# EAGLE design selecsch (EAGLE 9.6.2)
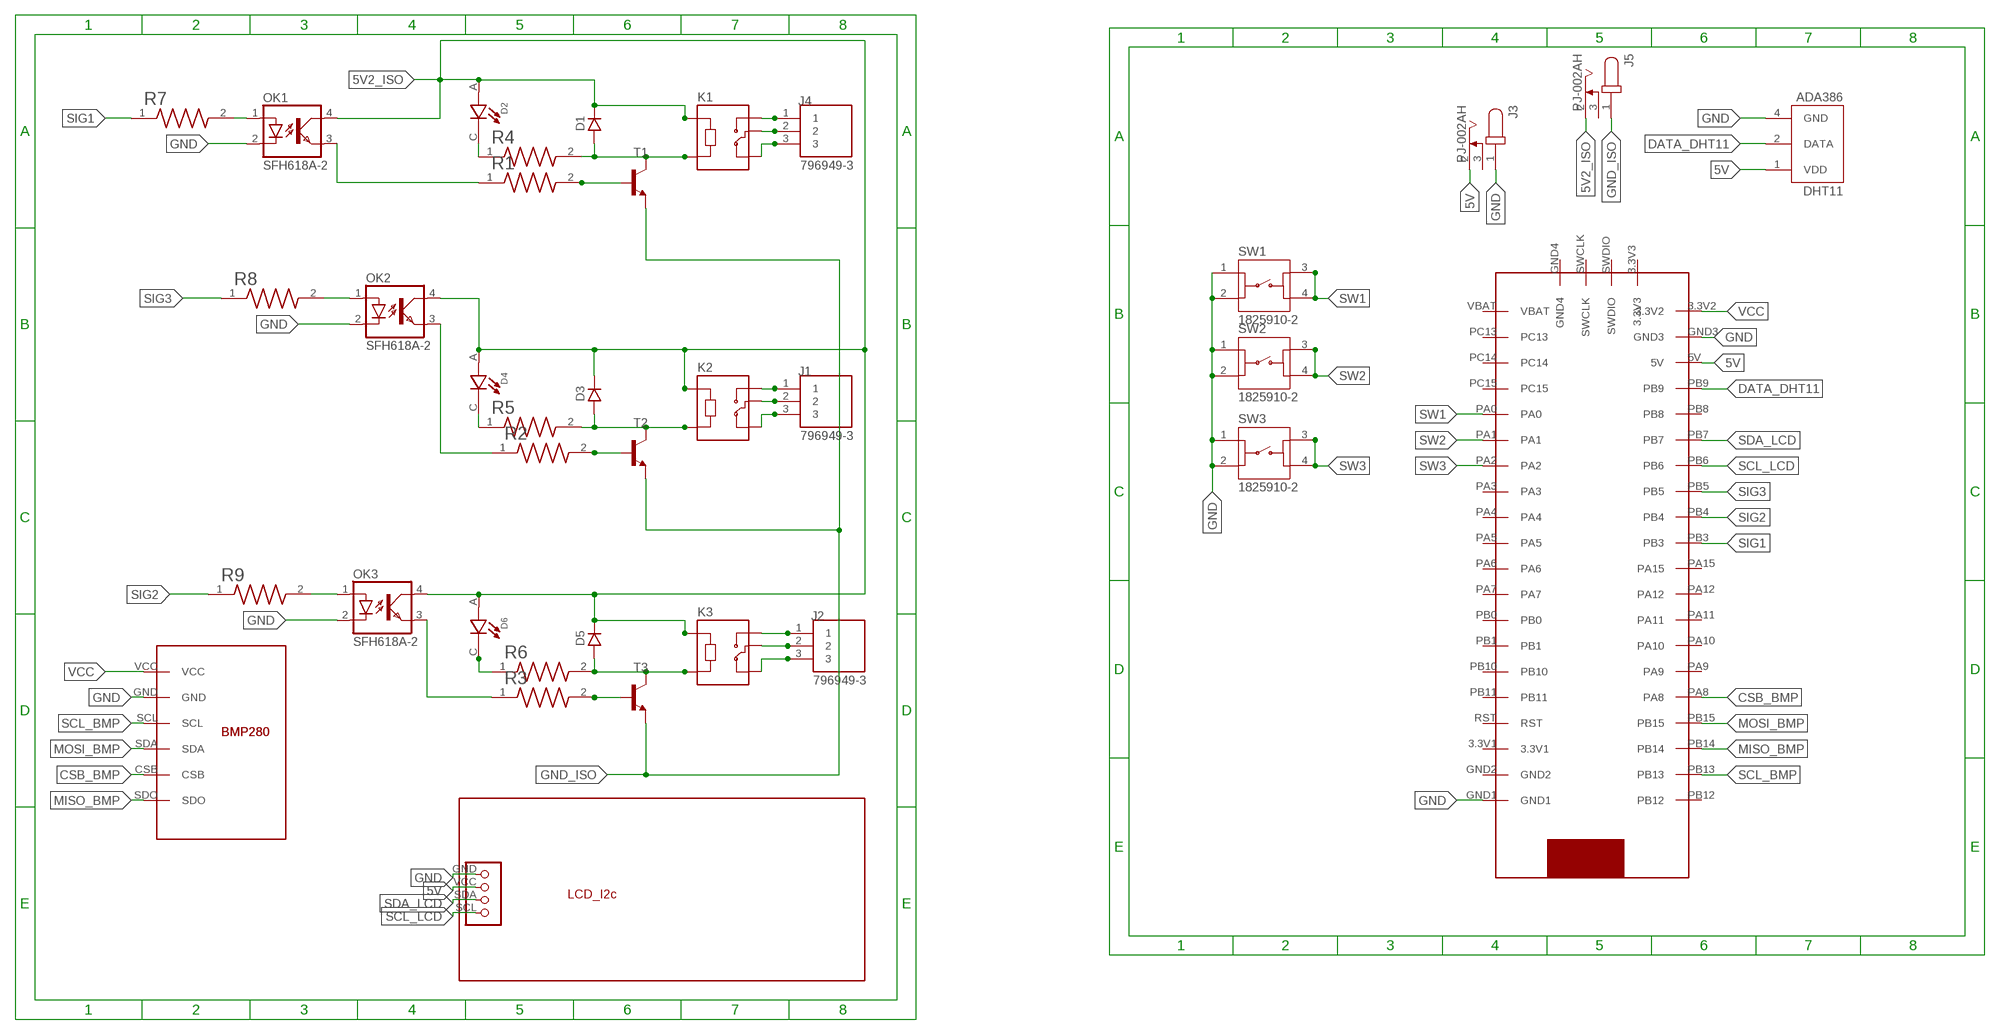
[diagram p0: schematic, sheet 1]

## Parts
D1  1N4007  [DO41]
D2  L08R5000Q1  [LEDRD254W57D500H1070]
D3  1N4007  [DO41]
D4  L08R5000Q1  [LEDRD254W57D500H1070]
D5  1N4007  [DO41]
D6  L08R5000Q1  [LEDRD254W57D500H1070]
DHT11  ADA386  [XDCR_ADA386]
J1  796949-3  [TE_796949-3]
J2  796949-3  [TE_796949-3]
J3  PJ-002AH  [CUI_PJ-002AH]
J4  796949-3  [TE_796949-3]
J5  PJ-002AH  [CUI_PJ-002AH]
K1  SRD-05VDC-SL-C  [RELAY_SRD-05VDC-SL-C]
K2  SRD-05VDC-SL-C  [RELAY_SRD-05VDC-SL-C]
K3  SRD-05VDC-SL-C  [RELAY_SRD-05VDC-SL-C]
LCD16X1  LCD16X2  [LCD16X2]
OK1  SFH618A-2  [DIP4]
OK2  SFH618A-2  [DIP4]
OK3  SFH618A-2  [DIP4]
R1  2-1623927-3  [RESAD700W45L350D185]
R2  2-1623927-3  [RESAD700W45L350D185]
R3  2-1623927-3  [RESAD700W45L350D185]
R4  2-1623927-3  [RESAD700W45L350D185]
R5  2-1623927-3  [RESAD700W45L350D185]
R6  2-1623927-3  [RESAD700W45L350D185]
R7  2-1623927-3  [RESAD700W45L350D185]
R8  2-1623927-3  [RESAD700W45L350D185]
R9  2-1623927-3  [RESAD700W45L350D185]
SW1  1825910-2  [TE_1825910-2]
SW2  1825910-2  [TE_1825910-2]
SW3  1825910-2  [TE_1825910-2]
T1  BC547TO92-CBE  [TO92-CBE]
T2  BC547TO92-CBE  [TO92-CBE]
T3  BC547TO92-CBE  [TO92-CBE]
U$1  BMP280  [BMP280]
U$2  STM32F103C8T6BLUEPILL  [STM32F103C8T6BLUEPILL]

## Nets
5V: DHT11.1(VDD) J3.2 LCD16X1.VCC U$2.5V
5V2_ISO: D1.K D2.A D3.K D4.A D5.K D6.A J5.2 K1.A1 K2.A1 K3.A1 OK1.4(COL) OK2.4(COL) OK3.4(COL)
CSB_BMP: U$1.CSB U$2.PA8
DATA_DHT11: DHT11.2(DATA) U$2.PB9
GND: DHT11.4(GND) J3.1 LCD16X1.GND SW1.1 SW1.2 SW2.1 SW2.2 SW3.1 SW3.2 U$1.GND U$2.GND1 U$2.GND3
GND_ISO: J5.1 T1.E T2.E T3.E
MISO_BMP: U$1.SDO U$2.PB14
MOSI_BMP: U$1.SDA U$2.PB15
N$1: D1.A K1.A2 R4.2 T1.C
N$2: R1.2 T1.B
N$3: J4.1 K1.NO
N$4: J4.2 K1.COM
N$5: J4.3 K1.NC
N$6: D3.A K2.A2 R5.2 T2.C
N$7: R2.2 T2.B
N$8: J1.1 K2.NO
N$9: D2.C R4.1
N$10: J1.2 K2.COM
N$11: J1.3 K2.NC
N$12: D5.A K3.A2 R6.2 T3.C
N$13: D6.C R6.1
N$14: R3.2 T3.B
N$15: J2.1 K3.NO
N$16: J2.2 K3.COM
N$17: J2.3 K3.NC
N$18: D4.C R5.1
N$19: OK1.3(EMIT) R1.1
N$20: OK3.3(EMIT) R3.1
N$21: OK1.2(C)
N$22: OK1.1(A) R7.2
N$23: OK3.1(A) R9.2
N$24: OK3.2(C)
N$25: OK2.1(A) R8.2
N$26: OK2.2(C)
N$27: OK2.3(EMIT) R2.1
SCL_BMP: U$1.SCL U$2.PB13
SCL_LCD: LCD16X1.SCL U$2.PB6
SDA_LCD: LCD16X1.SDA U$2.PB7
SIG1: R7.1 U$2.PB3
SIG2: R9.1 U$2.PB4
SIG3: R8.1 U$2.PB5
SW1: SW1.3 SW1.4 U$2.PA0
SW2: SW2.3 SW2.4 U$2.PA1
SW3: SW3.3 SW3.4 U$2.PA2
VCC: U$1.VCC U$2.3.3V2
Unconnected: J3.3 J5.3 U$2.3.3V1 U$2.3.3V3 U$2.GND2 U$2.GND4 U$2.PA3 U$2.PA4 U$2.PA5 U$2.PA6 U$2.PA7 U$2.PA9 U$2.PA10 U$2.PA11 U$2.PA12 U$2.PA15 U$2.PB0 U$2.PB1 U$2.PB8 U$2.PB10 U$2.PB11 U$2.PB12 U$2.PC13 U$2.PC14 U$2.PC15 U$2.RST U$2.SWCLK U$2.SWDIO U$2.VBAT

## Library data of the parts
D1 D3 D5 = 1N4007:1N4007: Usmernovaci dioda - 1A, 1000V Check availability <https://pricing.snapeda.com/parts/1N4007-T/Diodes%20Incorporated/view-part?ref=eda>; AVAILABILITY: In Stock; DESCRIPTION: Diode Standard 1000 V 1A Through Hole DO-41; MF: Diodes Incorporated; MP: 1N4007-T; PACKAGE: DO-41 Diodes Inc.; PRICE: None; PURCHASE-URL: https://pricing.snapeda.com/search/part/1N4007-T/?ref=eda
D2 D4 D6 = LED_orange:L08R5000Q1: LED, Orange, Through Hole, T-1 3/4 (5mm), 30 mA, 2.1 V, 635 nm Check availability <https://pricing.snapeda.com/parts/L08R5000Q1/LED%20Technology/view-part?ref=eda>; AVAILABILITY: In Stock; DESCRIPTION: LED, 5MM, ORANGE; LED / Lamp Size: 5mm / T-1 3/4; LED Colour: Orange; Typ Luminous Intensity: 4.3mcd; Viewing Angle: ...; MF: LED Technology; MP: L08R5000Q1; PACKAGE: None; PRICE: None
DHT11 = DHT11_sensor:ADA386: DHT11 basic temperature-humidity sensor + extras Check availability <https://pricing.snapeda.com/parts/ADA386/Adafruit%20Industries/view-part?ref=eda>; AVAILABILITY: Not in stock; DESCRIPTION: DHT11 basic temperature-humidity sensor + extras; MF: Adafruit Industries; MP: ADA386; PACKAGE: None; PRICE: None
J1 J2 J4 = 3_pin_terminal_connector_for relay:796949-3: Check availability <https://pricing.snapeda.com/parts/796949-3/TE%20Connectivity/view-part?ref=eda>; AVAILABILITY: In Stock; COMMENT: 796949-3; DESCRIPTION: Connector Terminal Blocks 3 Position 5.08mm Solder Straight Thru-Hole 17.5A/Contact; MF: TE Connectivity; MP: 796949-3; PACKAGE: None; PRICE: None; PURCHASE-URL: https://pricing.snapeda.com/search/part/796949-3/?ref=eda
J3 J5 = DC_jack:PJ-002AH: 2.0 mm Center Pin, 5.0 A, Right Angle, Through Hole, Dc Power Jack Connector Check availability <https://pricing.snapeda.com/parts/PJ-002AH/CUI%20Devices/view-part?ref=eda>; AVAILABILITY: In Stock; CUI_PURCHASE_URL: https://www.cuidevices.com/product/interconnect/connectors/dc-power-connectors/jacks/pj-002ah?utm_source=snapeda.com&utm_medium=referral&utm_campaign=snapedaBOM; DESCRIPTION: 2.0 x 6.5 mm, 5.0 A, Horizontal, Through Hole, Dc Power Jack Connector; MF: CUI Devices; MP: PJ-002AH; PACKAGE: None; PRICE: None; PURCHASE-URL: https://pricing.snapeda.com/search/part/PJ-002AH/?ref=eda
K1-K3 = SRD-05VDC-SL-C:SRD-05VDC-SL-C: 5V Trigger Relay Module For Arduino And Raspberry Pi 5V Trigger Relay Module For Arduino And Raspberry Pi; AVAILABILITY: Unavailable; DESCRIPTION: 5V Trigger Relay Module For Arduino And Raspberry Pi 5V Trigger Relay Module For Arduino And Raspberry Pi; MF: Songle Relay; MP: SRD-05VDC-SL-C; PACKAGE: None; PRICE: None
LCD16X1 = LCD16X2:LCD16X2
OK1-OK3 = optocoupler:SFH618?*: Optocoupler, Phototransistor Output, Low Input Current Source: Data sheet <http://www.vishay.com/docs/83673/sfh618.pdf>; MF: VISHAY/TELEFUNKEN; MPN: SFH618A-2; OC_FARNELL: 6424855; OC_NEWARK: 21H7744
R1-R9 = Resistor_1k:2-1623927-3: CFR16 5% 10K Check availability <https://pricing.snapeda.com/parts/2-1623927-3/TE%20Connectivity/view-part?ref=eda>; AVAILABILITY: In Stock; COMMENT: 2-1623927-3; DESCRIPTION: Carbon Film Resistors - Through Hole 1K Ohm 5% 1/4W Res Carbon Film; EU_ROHS_COMPLIANCE: Compliant; MF: TE Connectivity; MP: 2-1623927-3; PACKAGE: None; PRICE: None; PURCHASE-URL: https://pricing.snapeda.com/search/part/2-1623927-3/?ref=eda
SW1-SW3 = Push_button:1825910-2: SWITCH TACTILE SPST-NO 0.05A 24V Check availability <https://pricing.snapeda.com/parts/1825910-2/TE%20Connectivity/view-part?ref=eda>; AVAILABILITY: In Stock; COMMENT: 1825910-2; DESCRIPTION: 50 mA SPST Round Actuator 160 Gram Force Tactile Pushbutton Switch; EU_ROHS_COMPLIANCE: Compliant; MF: TE Connectivity; MP: 1825910-2; PACKAGE: None; PRICE: None; PURCHASE-URL: https://pricing.snapeda.com/search/part/1825910-2/?ref=eda
T1-T3 = BC547:BC547: NPN Transistror BF959 corrected 2008.03.06 Check availability <https://pricing.snapeda.com/parts/BC547/ON%20Semiconductor/view-part?ref=eda>; AVAILABILITY: In Stock; DESCRIPTION: Trans GP BJT NPN 45V 0.1A 500mW 3-Pin TO-92 T/R; MF: ON Semiconductor; MP: BC547; PACKAGE: None; PRICE: None; PURCHASE-URL: https://pricing.snapeda.com/search/part/BC547/?ref=eda
U$1 = BMP280:BMP280
U$2 = STM32F103C8T6bluepill:STM32F103C8T6BLUEPILL

## Module RELAY
Ports: 

### Library data of the parts

## Board
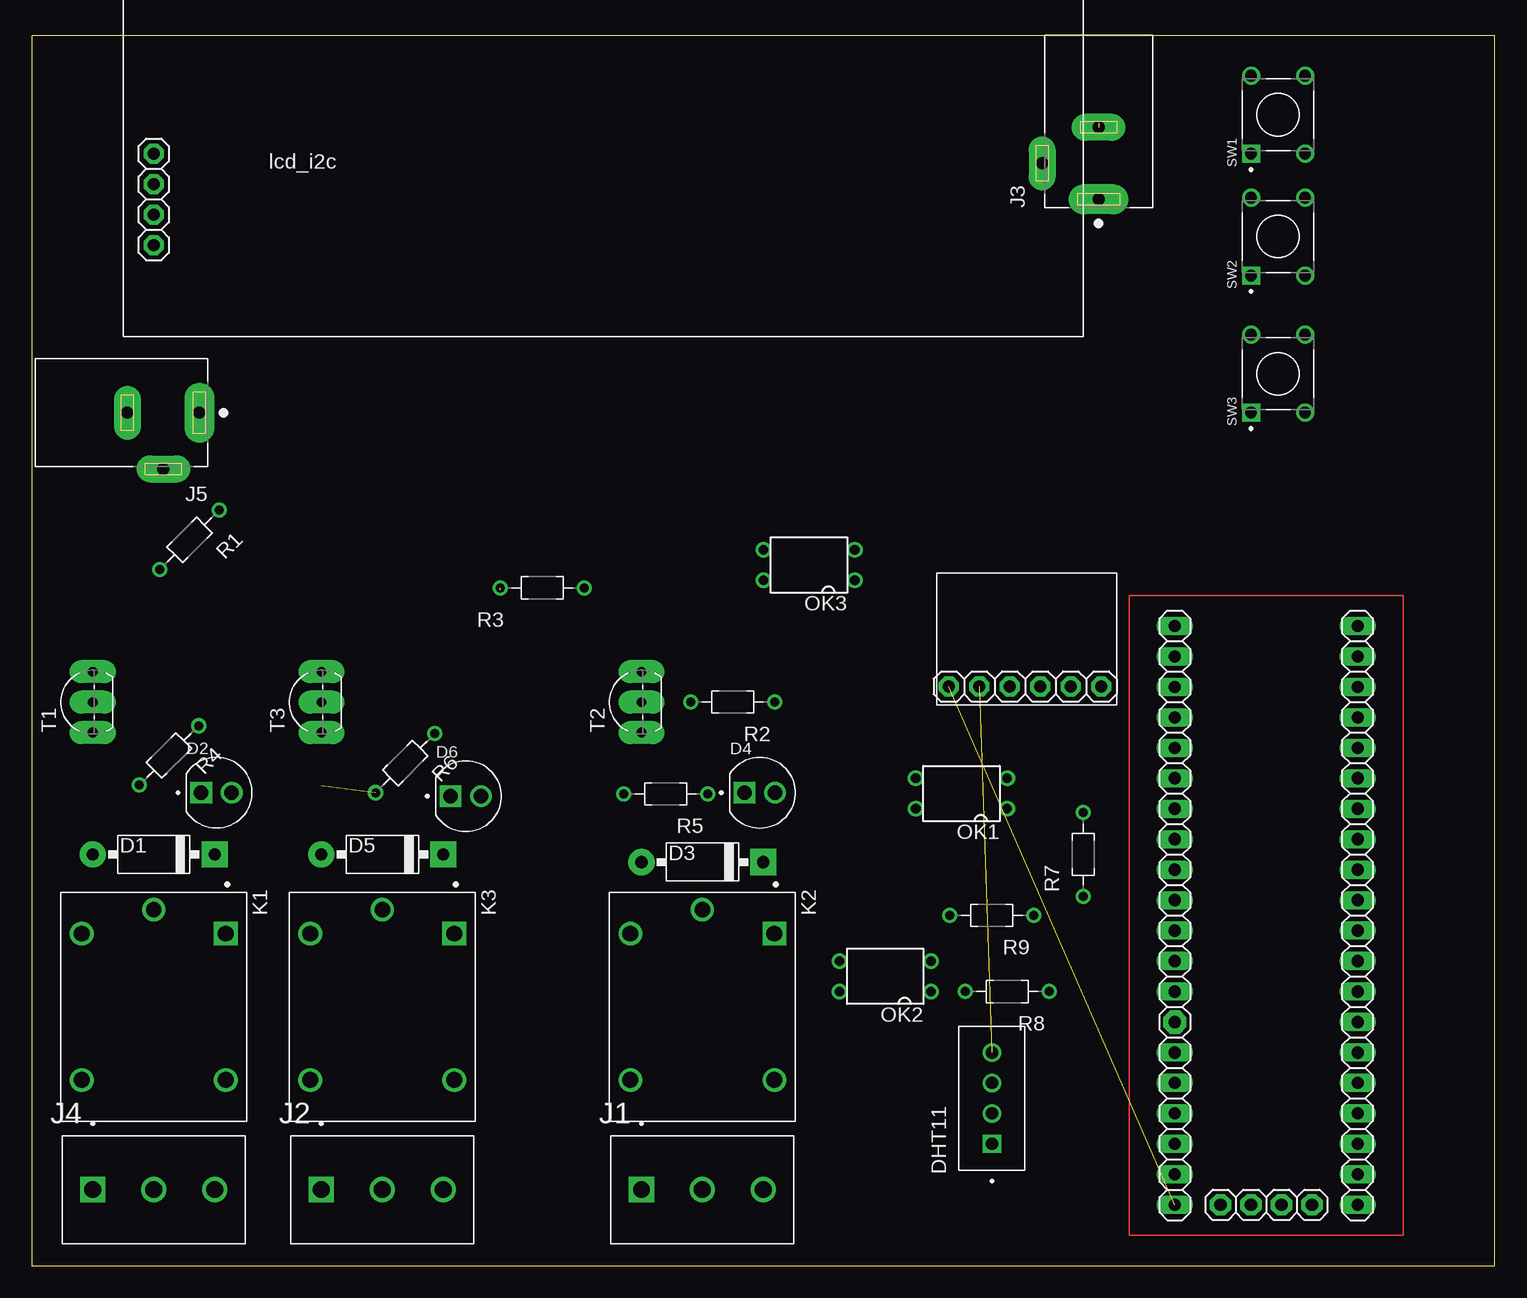
[diagram p1: board, top side]
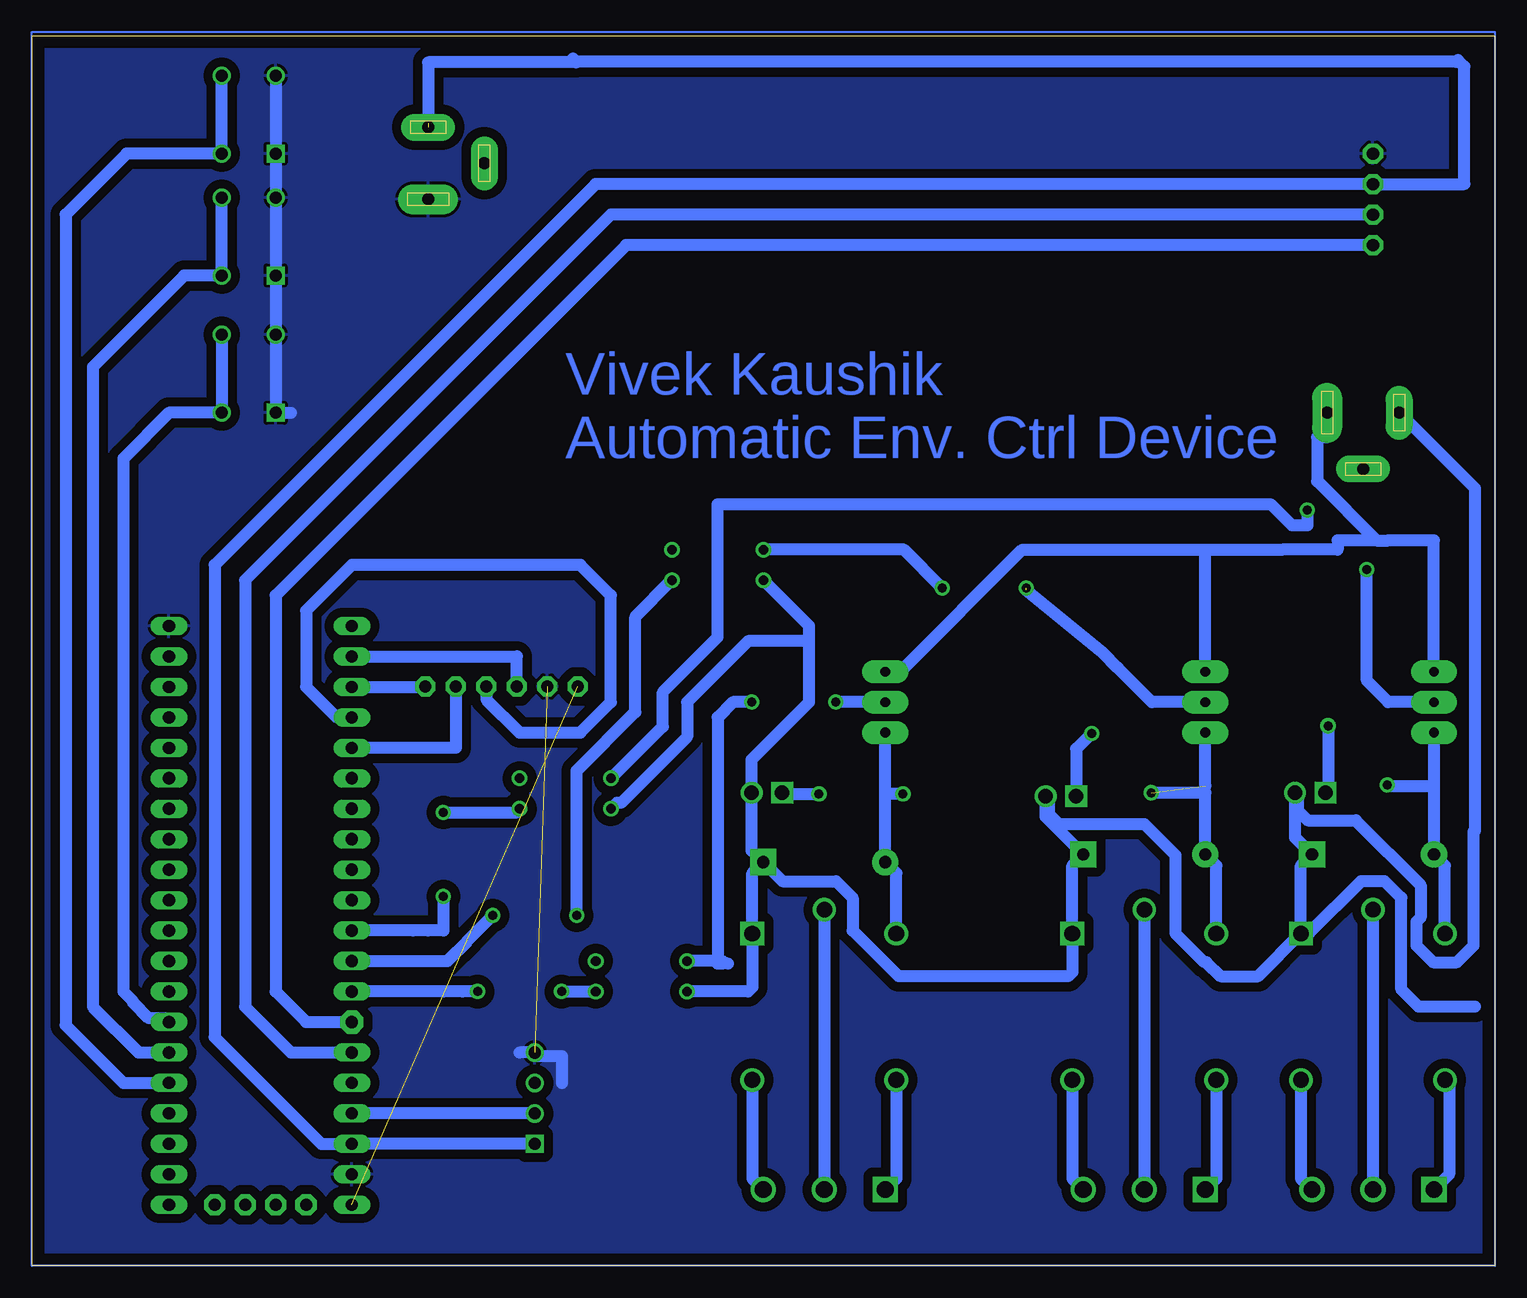
[diagram p2: board, bottom side, seen from below]

Size 121.9 x 102.54 mm. Coordinates in mm from the lower left corner, seen from the top.
Outline: 0,0 121.9,0 121.9,102.54 0,102.54 0,0
Copper layers (1*16): Top 0.035mm / dielectric 1.5mm / Bottom 0.035mm
Design rules "default *": minimum track width 6mil, minimum drill 0.35mm, track to track 30mil, track to pad 30mil, pad to pad 6mil, via to via 6mil, smd to smd 6mil, copper to edge 40mil, drill to drill 6mil, minimum pad ring 10mil, minimum via ring 8mil, stop-mask expansion 4mil, vias tented up to drill 0mil, thermal gap 10mil

### Footprints (pad centres in the part's own frame; a part is rotated, then mirrored left to right if it is on the bottom)
DO41 = drill 1.016 pad 2.184: A -5.08,0 | drill 1.016 pad 2.184 square: K 5.08,0
LEDRD254W57D500H1070 = drill 1.21: A 1.27,0 | drill 1.21 square: C -1.27,0
XDCR_ADA386 = drill 1.016 square: 1 -3.81,0 | drill 1.016: 2 -1.27,0; 3 1.27,0; 4 3.81,0
TE_796949-3 = drill 1.4 square: 1 -5.08,0 | drill 1.4: 2 0,0; 3 5.08,0
CUI_PJ-002AH = drill 1 pad 2.5 long: 1 0,0 | drill 1 pad 2.25 long: 2 6,0; 3 3,4.7
RELAY_SRD-05VDC-SL-C = drill 1.32 square: A1 -6.1,6 | drill 1.32: A2 -6.1,-6; NC 6.1,6; NO 6.1,-6 | drill 1.29: COM -8.1,0
LCD16X2 = drill 1.016 pad 1.676 octagon: GND 15.24,77.47; SCL 7.62,77.47; SDA 10.16,77.47; VCC 12.7,77.47
DIP4 = drill 0.8: 1 -1.27,-3.81; 2 1.27,-3.81; 3 1.27,3.81; 4 -1.27,3.81
RESAD700W45L350D185 = drill 0.75: 1 -3.5,0; 2 3.5,0
TE_1825910-2 = drill 0.99 square: 1 0,0 | drill 0.99: 2 6.5,0; 3 0,-4.5; 4 6.5,-4.5
TO92-CBE = drill 0.813 pad 1.93 long: B 0,0; C -2.54,0; E 2.54,0
BMP280 = drill 1.016 pad 1.676 octagon: CSB 1.54,3.81; GND 1.54,11.43; SCL 1.54,8.89; SDA 1.54,6.35; SDO 1.54,1.27; VCC 1.54,13.97
STM32F103C8T6BLUEPILL = drill 1.016 long: 3.3V1 19.05,45.72; 3.3V2 3.81,2.54; 5V 3.81,7.62; GND1 19.05,50.8; GND2 19.05,48.26; GND3 3.81,5.08; PA0 19.05,12.7; PA1 19.05,15.24; PA2 19.05,17.78; PA3 19.05,20.32; PA4 19.05,22.86; PA5 19.05,25.4; PA6 19.05,27.94; PA7 19.05,30.48; PA8 3.81,40.64; PA9 3.81,38.1; PA10 3.81,35.56; PA11 3.81,33.02; PA12 3.81,30.48; PA15 3.81,27.94; PB0 19.05,33.02; PB1 19.05,35.56; PB3 3.81,25.4; PB4 3.81,22.86; PB5 3.81,20.32; PB7 3.81,15.24; PB8 3.81,12.7; PB9 3.81,10.16; PB10 19.05,38.1; PB11 19.05,40.64; PB12 3.81,50.8; PB13 3.81,48.26; PB14 3.81,45.72; PB15 3.81,43.18; PC13 19.05,5.08; PC14 19.05,7.62; PC15 19.05,10.16; RST 19.05,43.18; VBAT 19.05,2.54 | drill 1.016 pad 1.778 octagon: 3.3V3 7.62,2.54; GND4 15.24,2.54; SWCLK 12.7,2.54; SWDIO 10.16,2.54 | drill 1.016 pad 1.93 octagon: PB6 3.81,17.78

### Placement (x,y rotation side)
D1  10.16,34.29 0 top
D2  15.38,39.45 0 top
D3  55.88,33.66 0 top
D4  60.66,39.43 0 top
D5  29.21,34.29 0 top
D6  36.16,39.15 0 top
DHT11  80.01,13.97 90 top
J1  55.88,6.35 0 top
J2  29.21,6.35 0 top
J3  88.9,88.9 90 top
J4  10.16,6.35 0 top
J5  13.97,71.12 180 top
K1  10.16,21.59 270 top
K2  55.88,21.59 270 top
K3  29.21,21.59 270 top
LCD16X1  87.63,77.47 90 top
OK1  77.47,39.37 90 top
OK2  71.12,24.13 90 top
OK3  64.77,58.42 90 top
R1  13.15,60.51 225 top
R2  58.42,46.99 180 top
R3  42.54,56.52 180 top
R4  11.43,42.55 225 top
R5  52.82,39.33 180 top
R6  31.11,41.91 225 top
R7  87.63,34.29 90 top
R8  81.28,22.86 180 top
R9  80.01,29.21 180 top
SW1  101.6,92.71 90 top
SW2  101.6,82.55 90 top
SW3  101.6,71.12 90 top
T1  5.08,46.99 90 top
T2  50.8,46.99 90 top
T3  24.13,46.99 90 top
U$1  90.39,46.75 90 top
U$2  91.44,2.54 0 top

### Tracks (layer width: path | path; a pad name or v marks a point on that pad's centre or on a via)
5V  (1 unrouted)
  Bottom 1.016: 76.55,100.38 3.22,100.38 3.08,100.51 2.54,99.97 2.54,90.17 LCD16X1.VCC 74.93,90.17 106.68,58.42 106.68,19.05 97.79,10.16 U$2.5V DHT11.1 | 76.81,100.63 76.55,100.38 | 76.55,100.38 76.55,100.33 88.9,100.33 88.9,95.25
5V2_ISO
  Bottom 1.016: K1.A1 16.16,33.37 D1.K 16.65,35.7 D2.A 16.42,39.21 16.42,37.96 15.6,37.14 11.58,37.14 6.19,31.75 6.19,29.03 6.55,28.68 6.55,26.7 5.15,25.3 3.17,25.3 1.77,26.7 1.77,36.17 1.65,36.29 1.65,64.8 J5.2 | D3.K 61.93,34.63 D4.A 61.93,42.21 57.15,46.99 57.15,52.07 | D3.K 61.88,32.73 K2.A1 61.88,23.21 62.23,22.86 OK2.4 | 57.15,52.07 57.15,53.34 OK3.4 | K1.A1 19.72,24.13 22.86,24.13 24.03,25.3 24.2,25.3 26.62,27.72 26.62,34.24 29.21,36.83 36.36,36.83 37.19,37.66 37.19,38.91 D6.A 37.43,37.43 D5.K 35.21,33.37 K3.A1 35.21,24.48 35.56,24.13 49.7,24.13 53.51,27.95 53.51,30.67 54.9,32.05 59.36,32.05 D3.K | 1.65,21.59 6.35,21.59 7.8,23.04 7.8,30.67 9.18,32.05 11.14,32.05 15.5,27.69 K1.A1 | 57.15,52.07 62.23,52.07 67.31,46.99 67.31,44.09 72.81,38.59 73.17,38.59 OK1.4
CSB_BMP
  Bottom 1.016: U$1.CSB 86.58,43.18 U$2.PA8
DATA_DHT11
  Bottom 1.016: DHT11.2 U$2.PB9
GND  (1 unrouted)
  Bottom 1.016: 100.33,71.12 SW3.1 SW1.2 | 77.75,15.24 77.75,17.5 80.01,17.5 DHT11.4 81.28,17.78
  pour Bottom: 0,102.87 0,0 121.92,0 121.92,102.87
GND_ISO
  Bottom 1.016: T2.E 49.53,49.53 39.37,59.69 24.13,59.69 | 17.73,59.69 | 24.13,59.69 17.73,59.69 | T3.E 24.13,59.69 | 17.73,59.69 13.1,59.69 13.1,60.47 9.87,60.47 | T1.E 5.08,60.47 8.89,60.47 9.87,60.47 | J5.1 13.97,69.04 14.82,69.04 14.82,65.42 9.87,60.47
MISO_BMP
  Bottom 1.016: U$2.PB14 89.15,48.26 U$1.SDO
MOSI_BMP
  Bottom 1.016: U$1.SDA 84.04,47.21 81.28,44.45 76.2,44.45 73.66,46.99 73.66,55.88 76.2,58.42 95.25,58.42 99.06,54.61 99.06,48.26 96.52,45.72 U$2.PB15
N$1
  Bottom 1.016: K1.A2 4.16,33.37 D1.A 5.08,40.01 | T1.C 5.08,40.01 | R4.2 8.89,40.01 5.08,40.01
N$2
  Bottom 1.016: T1.B 8.89,46.99 10.67,48.77 R1.2
N$3
  Bottom 1.016: 4.16,7.27 J4.1 3.81,7.62 3.81,15.14 K1.NO
N$4
  Bottom 1.016: K1.COM J4.2
N$5
  Bottom 1.016: K1.NC 16.16,7.27 J4.3
N$6
  Bottom 1.016: K2.A2 49.88,32.73 D3.A 50.8,39.33 | 50.8,39.33 T2.C | R5.2 50.8,39.33
N$7
  Bottom 1.016: T2.B R2.2
N$8
  Bottom 1.016: K2.NO 49.88,7.27 J1.1
N$9
  Bottom 1.016: D2.C 13.91,39.65 R4.1
N$10
  Bottom 1.016: K2.COM J1.2
N$11
  Bottom 1.016: K2.NC 61.88,7.27 J1.3
N$12  (1 unrouted)
  Bottom 1.016: 24.13,40.01 T3.C | K3.A2 23.21,33.37 D5.A 24.13,39.44 R6.2
N$13
  Bottom 1.016: R6.1 34.89,43.09 D6.C
N$14  (1 unrouted)
  Bottom 1.016: T3.B 28.57,46.99 31.43,49.84 32.7,51.11 39.04,56.33
N$15
  Bottom 1.016: K3.NO 23.21,7.27 J2.1
N$16
  Bottom 1.016: K3.COM J2.2
N$17
  Bottom 1.016: K3.NC 35.21,7.27 J2.3
N$18
  Bottom 1.016: D4.C 59.29,39.33 R5.1
N$19
  Bottom 1.016: OK1.3 69.34,44.96 69.34,47.83 64.77,52.4 64.77,63.5 18.68,63.5 16.9,61.72 16.89,61.72 15.62,61.72 R1.1
N$20
  Bottom 1.016: R3.1 49.22,59.69 OK3.3
N$22
  Bottom 1.016: R7.2 81.59,37.79 OK1.1
N$23
  Bottom 1.016: OK3.1 71.63,54.1 71.63,46.15 76.51,41.27 R9.2
N$25
  Bottom 1.016: R8.2 OK2.1
N$27
  Bottom 1.016: R2.1 63.5,46.99 64.77,45.72 64.77,25.2 64.37,25.2 | 63.91,25.2 64.37,25.2 | 64.37,25.2 64.37,25.4 OK2.3
N$28
  Bottom 0.152: 0,102.87 0,0 121.92,0 121.92,102.87 0,102.87
SCL_BMP
  Bottom 1.016: U$2.PB13 81.5,50.8 U$1.SCL
SCL_LCD
  Bottom 1.016: U$2.PB6 99.06,20.32 101.6,22.86 101.6,55.88 72.39,85.09 LCD16X1.SCL
SDA_LCD
  Bottom 1.016: U$2.PB7 100.33,17.78 104.14,21.59 104.14,57.15 73.66,87.63 LCD16X1.SDA
SIG1
  Bottom 1.016: U$2.PB3 90.17,27.94 88.9,27.94 87.63,27.94 R7.1
SIG2
  Bottom 1.016: R9.1 85.6,27.12 85.6,27.1 87.3,25.4 U$2.PB4
SIG3
  Bottom 1.016: U$2.PB5 87.63,22.86 86.05,22.86 R8.1
SW1
  Bottom 1.016: SW1.4 SW1.3 114.03,92.71 119.11,87.63 119.11,20.05 114.3,15.24 U$2.PA0
SW2
  Bottom 1.016: SW2.4 SW2.3 109.22,82.55 116.84,74.93 116.84,21.59 113.03,17.78 U$2.PA1
SW3
  Bottom 1.016: SW3.4 SW3.3 110.49,71.12 114.3,67.31 114.3,22.86 113.48,22.04 113.48,21.94 112.17,20.64 110.81,20.64 U$2.PA2
VCC  (1 unrouted)

### Text on the board
Bottom: Vivek Kaushik / Automatic Env. Ctrl Device